# Altium schematic sheet peripheral.SchDoc
size A4
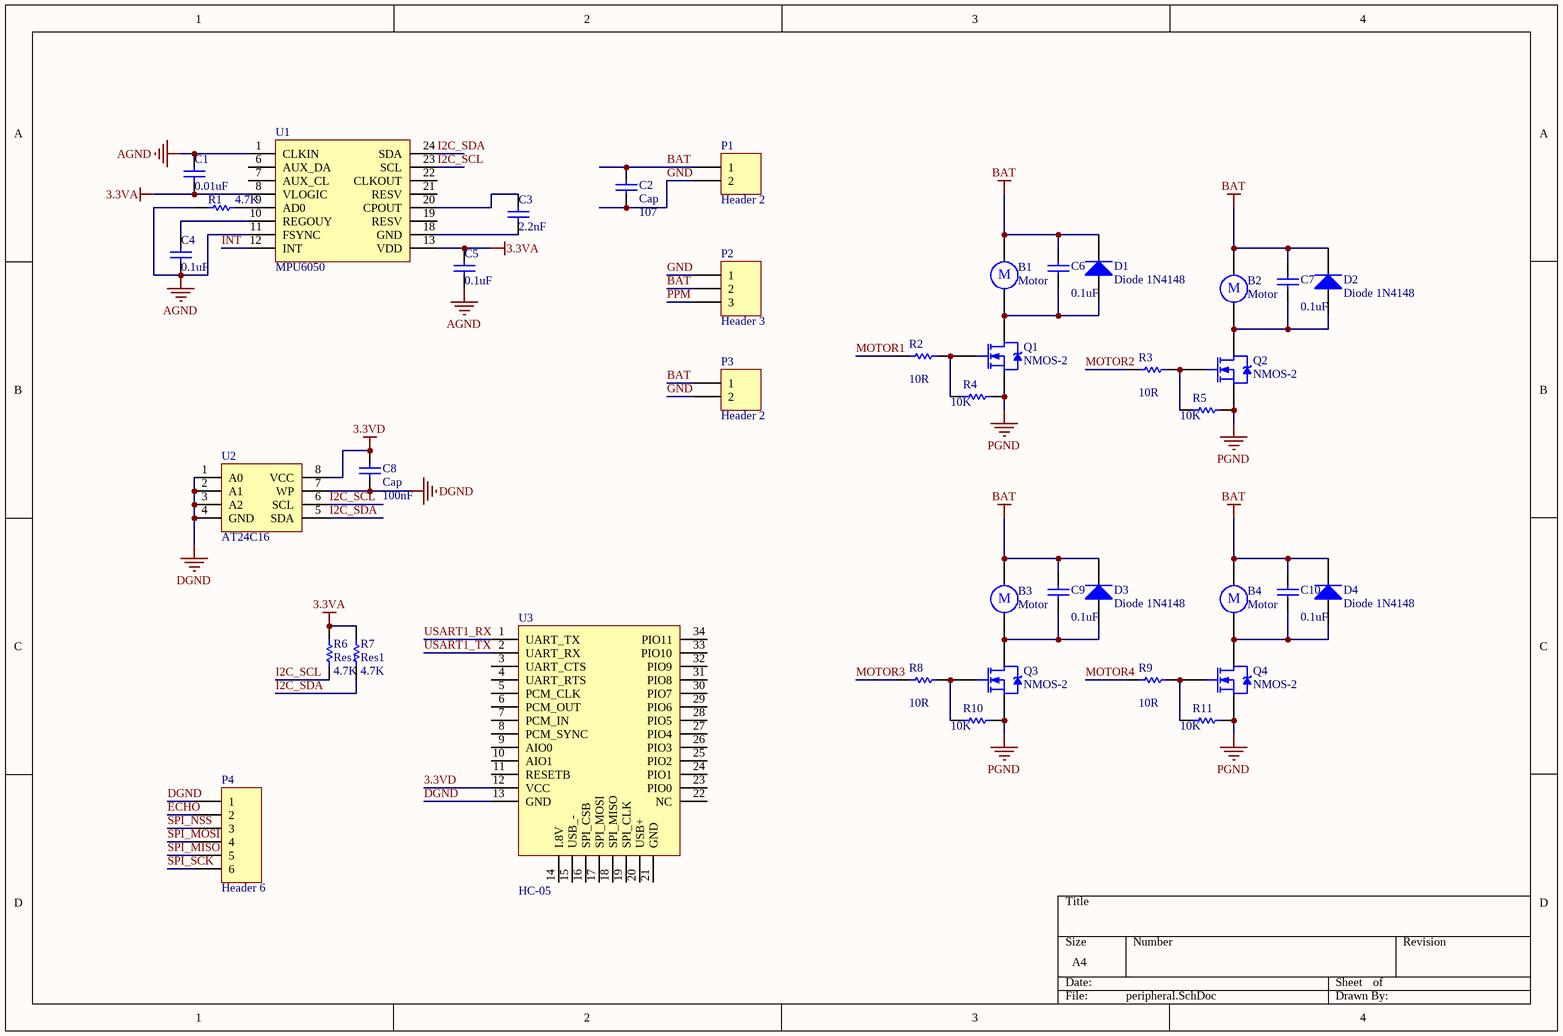
[diagram p0: peripheral.SchDoc]

## Parts
B1  Motor  [HDR1X2]
B2  Motor  [HDR1X2]
B3  Motor  [HDR1X2]
B4  Motor  [HDR1X2]
C1  value 0.01uF  [C0402]  (hidden comment: Cap)
C2  Cap  value 107  [1206R]
C3  value 2.2nF  [C0402]  (hidden comment: Cap)
C4  value 0.1uF  [C0402]  (hidden comment: Cap)
C5  value 0.1uF  [C0402]  (hidden comment: Cap)
C6  value 0.1uF  [c0603]  (hidden comment: Cap)
C7  value 0.1uF  [c0603]  (hidden comment: Cap)
C8  Cap  value 100nF  [C0402]
C9  value 0.1uF  [c0603]  (hidden comment: Cap)
C10  value 0.1uF  [c0603]  (hidden comment: Cap)
D1  Diode 1N4148  [SOD-523]
D2  Diode 1N4148  [SOD-523]
D3  Diode 1N4148  [SOD-523]
D4  Diode 1N4148  [SOD-523]
P1  Header 2  [BATHOLE]
P2  Header 3  [HDR1X3]
P3  Header 2  [BATHOLE]
P4  Header 6  [1.0*6PIN/SMD H]
Q1  NMOS-2  [WDFN8 3.3*3.3,0.65P]
Q2  NMOS-2  [WDFN8 3.3*3.3,0.65P]
Q3  NMOS-2  [WDFN8 3.3*3.3,0.65P]
Q4  NMOS-2  [WDFN8 3.3*3.3,0.65P]
R1  value 4.7K  [R0402]  (hidden comment: Res1)
R2  value 10R  [R0402]  (hidden comment: Res1)
R3  value 10R  [R0402]  (hidden comment: Res1)
R4  value 10K  [R0402]  (hidden comment: Res1)
R5  value 10K  [R0402]  (hidden comment: Res1)
R6  Res1  value 4.7K  [R0402]
R7  Res1  value 4.7K  [R0402]
R8  value 10R  [R0402]  (hidden comment: Res1)
R9  value 10R  [R0402]  (hidden comment: Res1)
R10  value 10K  [R0402]  (hidden comment: Res1)
R11  value 10K  [R0402]  (hidden comment: Res1)
U1  MPU6050  [QFN24]
U2  AT24C16  [TSSOP8]
U3  HC-05  [hc05]

## Nets
3.3VA: C1.1 C5.2 R6.2 R7.2 U1.8(VLOGIC) U1.13(VDD)
3.3VD: C8.2 U2.8(VCC) U3.12(VCC)
AGND: C1.2 C4.1 C5.1 R1.2 U1.1(CLKIN) U1.11(FSYNC)
BAT: B1.1 B2.1 B3.1 B4.1 C2.2 C6.2 C7.2 C9.2 C10.2 D1.2(K) D2.2(K) D3.2(K) D4.2(K) P1.1 P2.2 P3.1
DGND: C8.1 P4.1 U2.1(A0) U2.2(A1) U2.3(A2) U2.4(GND) U2.7(WP) U3.13(GND)
PGND: Q1.2(S) Q2.2(S) Q3.2(S) Q4.2(S) R4.2 R5.2 R10.2 R11.2
ECHO: P4.2
GND: C2.1 P1.2 P2.1 P3.2
I2C_SCL: R6.1 U1.23(SCL) U2.6(SCL)
I2C_SDA: R7.1 U1.24(SDA) U2.5(SDA)
INT: U1.12(INT)
MOTOR1: R2.1
MOTOR2: R3.1
MOTOR3: R8.1
MOTOR4: R9.1
PPM: P2.3
SPI_MISO: P4.5
SPI_MOSI: P4.4
SPI_NSS: P4.3
SPI_SCK: P4.6
USART1_RX: U3.1(UART_TX)
USART1_TX: U3.2(UART_RX)
NetB1_2: B1.2 C6.1 D1.1(A) Q1.3(D)
NetB2_2: B2.2 C7.1 D2.1(A) Q2.3(D)
NetB3_2: B3.2 C9.1 D3.1(A) Q3.3(D)
NetB4_2: B4.2 C10.1 D4.1(A) Q4.3(D)
NetC3_1: C3.1 U1.18(GND)
NetC3_2: C3.2 U1.20(CPOUT)
NetC4_2: C4.2 U1.10(REGOUY)
NetQ1_1: Q1.1(G) R2.2 R4.1
NetQ2_1: Q2.1(G) R3.2 R5.1
NetQ3_1: Q3.1(G) R8.2 R10.1
NetQ4_1: Q4.1(G) R9.2 R11.1
NetR1_1: R1.1 U1.9(AD0)

Not connected (* = marked no-connect by the designer): U1 6(AUX_DA) 7(AUX_CL) 19(RESV) 21(RESV) 22(CLKOUT); U3 3(UART_CTS) 4(UART_RTS) 5(PCM_CLK) 6(PCM_OUT) 7(PCM_IN) 8(PCM_SYNC) 9(AIO0) 10(AIO1) 11(RESETB) 14(I.8V) 15(USB_-) 16(SPI_CSB) 17(SPI_MOSI) 18(SPI_MISO) 19(SPI_CLK) 20(USB+) 21(GND) 22(NC) 23(PIO0) 24(PIO1) 25(PIO2) 26(PIO3) 27(PIO4) 28(PIO5) 29(PIO6) 30(PIO7) 31(PIO8) 32(PIO9) 33(PIO10) 34(PIO11)

## Notes on the sheet
- (in symbol Motor) M

## Library data of the parts
B1-B4 = Motor: Motor, General Kind; Published: 24-Mar-1999; LatestRevisionDate: 17-Jul-2002; LatestRevisionNote: Re-released for DXP Platform.; PackageReference: RB5-10.5; Publisher: Altium Limited
C1-C10 = Cap: Capacitor; Published: 8-Jun-2000; LatestRevisionDate: 17-Jul-2002; LatestRevisionNote: Re-released for DXP Platform.; PackageReference: RAD-0.3; Publisher: Altium Limited
D1-D4 = Diode 1N4148: High Conductance Fast Diode; Published: 8-Jun-2000; LatestRevisionDate: 17-Jul-2002; LatestRevisionNote: Re-released for DXP Platform.; DatasheetDocument: 1997; PackageReference: DO-35; Publisher: Altium Limited; Code_JEDEC: DO-204-AH; ComponentLink1Description: Manufacturer Link; ComponentLink1URL: http://www.fairchildsemi.com/; ComponentLink2Description: Datasheet; ComponentLink2URL: http://www.fairchildsemi.com/ds/1N%2F1N4148.pdf
P1 P3 = Header 2: Header, 2-Pin; LatestRevisionDate: 17-Jul-2002; LatestRevisionNote: Re-released for DXP Platform.; Publisher: Altium Limited
P2 = Header 3: Header, 3-Pin; LatestRevisionDate: 17-Jul-2002; LatestRevisionNote: Re-released for DXP Platform.; Publisher: Altium Limited
P4 = Header 6: Header, 6-Pin; LatestRevisionDate: 17-Jul-2002; LatestRevisionNote: Re-released for DXP Platform.; Publisher: Altium Limited
Q1-Q4 = NMOS-2: N-Channel Power MOSFET; Note: Pin 2 is electrically connected to pin 4.; Published: 8-Jun-2000; LatestRevisionDate: 17-Jul-2002; LatestRevisionNote: Re-released for DXP Platform.; DatasheetDocument: PD-9.814; PackageReference: TO-220AB; Publisher: Altium Limited; Code_JEDEC: TO-220-AB; ComponentLink1Description: Manufacturer Link; ComponentLink1URL: http://www.irf.com/
R1-R11 = Res1: Resistor; Published: 8-Jun-2000; LatestRevisionDate: 17-Jul-2002; LatestRevisionNote: Re-released for DXP Platform.; PackageReference: AXIAL-0.3; Publisher: Altium Limited
U3 = HC05